# Altium schematic sheet [07] - POWER SUPPLY.SchDoc: Desk Digital Clock
size A4; DrawnBy: Ramil Teregulov; Address1: http://github.com/teregulov; Address2: http://github.com/teregulov/Desk-Digital-Clock; DocumentNumber: DDC-7; Revision: 1R0; SheetNumber: 7; SheetTotal: 7
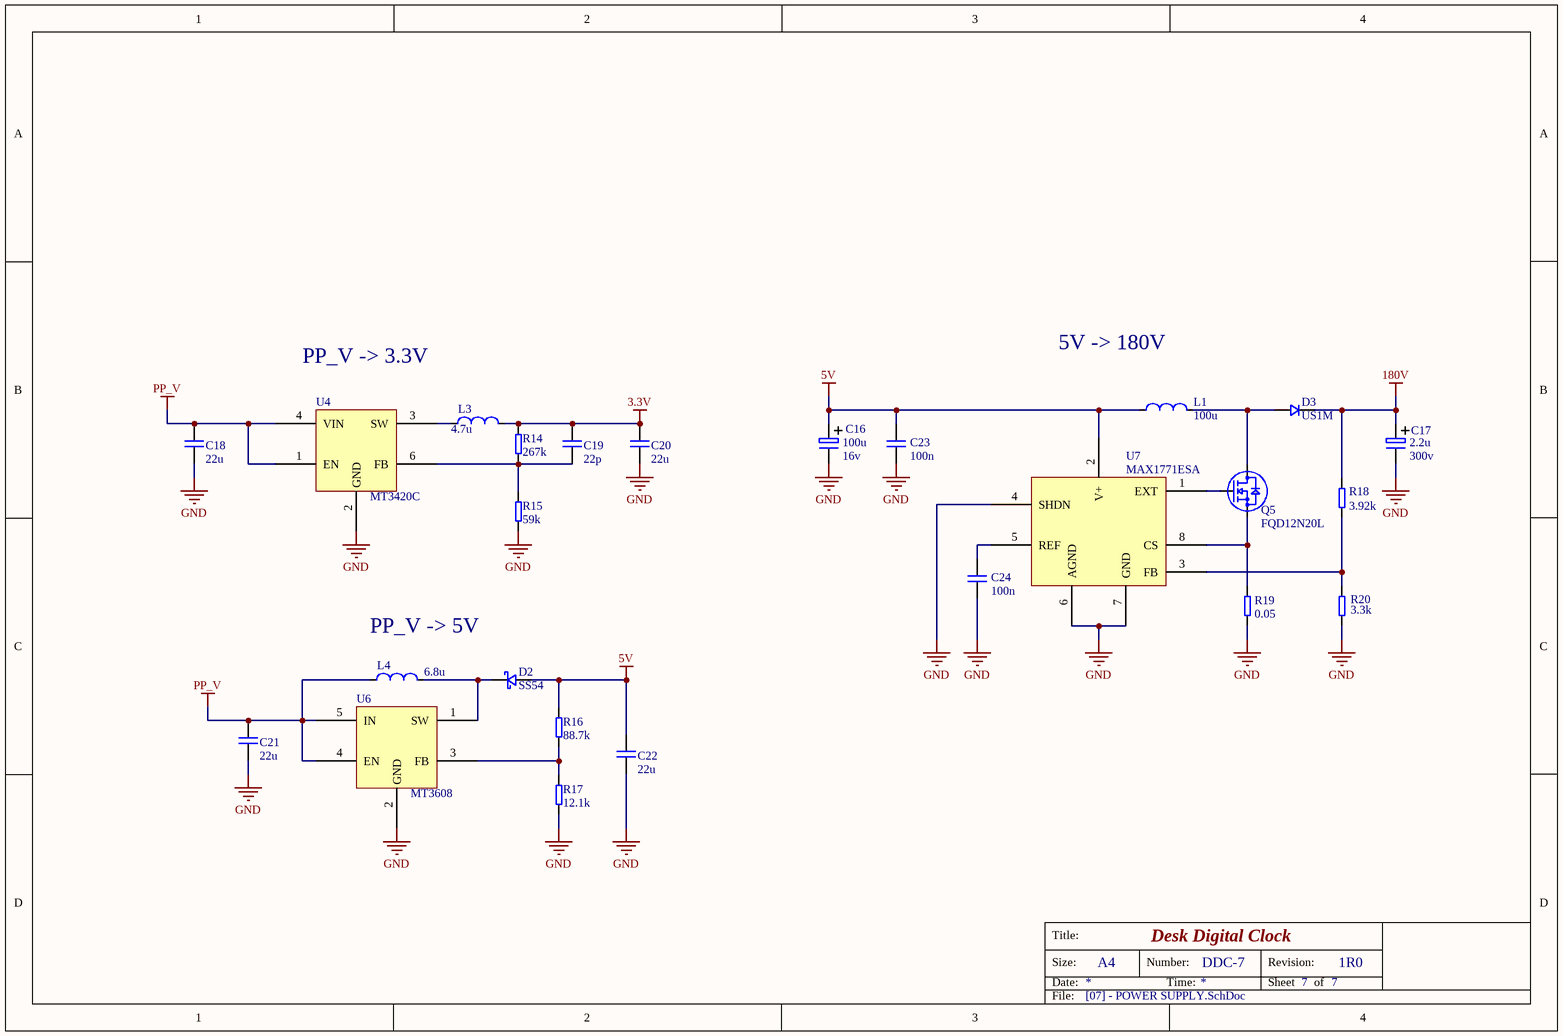
[diagram p0: [07] - POWER SUPPLY.SchDoc]

## Parts
C16  Voltage: 16v  [CAPM3216X18N_TANTAL_E]  (hidden comment: 100u)
C17  Voltage: 300v  [CAP_8X10.2]  (hidden comment: 2.2u)
C18  22u  [C1210]
C19  22p  [C0603]
C20  22u  [C1210]
C21  22u  [C1210]
C22  22u  [C1210]
C23  100n  [C0603]
C24  100n  [C0603]
D2  P/N: SS54  [DIOM6959X26N-SS54]
D3  (no value)  [DO-214AC(SMA)]
L1  100u  [CD127-IND]
L3  4.7u  [CDRH5D16]
L4  6.8u  [CDRH5D16]
Q5  FQD12N20L  [DPAK-fqd12n20l]
R14  267k  [R0603]
R15  59k  [R0603]
R16  88.7k  [R0603]
R17  12.1k  [R0603]
R18  3.92k  [R0603]
R19  0.05  [R1206]
R20  3.3k  [R0603]
U4  MT3420C  [SOT23-6-MT3420C]
U6  MT3608  [SOT23-6-MT3420C]
U7  MAX1771ESA  [MAX1771ESA]

## Nets
3.3V: C19.2 C20.2 L3.2 R14.2
5V: C16.1 C22.2 C23.2 D2.2 L1.1 R16.2 U7.2(V+)
180V: C17.1 D3.1 R18.2
GND: C16.2 C17.2 C18.1 C20.1 C21.1 C22.1 C23.1 C24.1 R15.1 R17.1 R19.1 R20.1 U4.2(GND) U6.2(GND) U7.4(SHDN) U7.6(AGND) U7.7(GND)
PP_V: C18.2 C21.2 L4.1 U4.1(EN) U4.4(VIN) U6.4(EN) U6.5(IN)
NetC19_1: C19.1 R14.1 R15.2 U4.6(FB)
NetC24_2: C24.2 U7.5(REF)
NetD2_1: D2.1 L4.2 U6.1(SW)
NetD3_2: D3.2 L1.2 Q5.D
NetL3_1: L3.1 U4.3(SW)
NetQ5_G: Q5.G U7.1(EXT)
NetQ5_S: Q5.S R19.2 U7.8(CS)
NetR16_1: R16.1 R17.2 U6.3(FB)
NetR18_1: R18.1 R20.2 U7.3(FB)

## Notes on the sheet
- PP_V -> 3.3V
- 5V -> 180V
- PP_V -> 5V
- Title:
- Size:
- Date:
- A4
- Number:
- Time:
- Revision:
- Sheet
- of
- File:

## Library data of the parts
C16 C17 = Cap_p: CAPACITOR
  C16: Value: 100u
  C17: Value: 2.2u
C18-C24 = Cap: CAPACITOR
  C18 C20-C22: Value: 22u
  C19: Value: 22p
  C23 C24: Value: 100n
D2 = Diode_Shottky: Diode Shottky; Datasheet: https://static.chipdip.ru/lib/321/DOC005321659.pdf
D3 = US1M: 1.0A SURFACE MOUNT ULTRA-FAST RECTIFIER; Manufacturer: Vishay; Datasheet: https://www.vishay.com/docs/88768/us1_test_dcicons.pdf; P/N: US1M
L1 = Ind: INDUCTOR; Value: 100u
L3 = Ind: INDUCTOR; P/N: CDRH5D16NP-4R7NC; Value: 4.7u
L4 = Ind: INDUCTOR; P/N: CDRH5D16NP-680MC; Value: 6.8u
Q5 = FQD12N20L: n-Channel QFET MOSFET 200V 9A 280mOhm; Manufacturer: Fairchild Semiconductor; P/N: FQD12N20L; Datasheet: https://www.onsemi.com/download/data-sheet/pdf/fqd12n20l-d.pdf; Package: D-PAK
R14-R20 = Res: RESISTOR
  R14: Value: 267k
  R15: Value: 59k
  R16: Value: 88.7k
  R17: Value: 12.1k
  R18: Value: 3.92k
  R19: Value: 0.05
  R20: Value: 3.3k
U4 = MT3420C: 2A 2.3-6V Input 1.5MHz Synchronous Step-Down Converter; Manufacturer: Aerosemi; Datasheet: https://datasheet.lcsc.com/lcsc/1806041635_XI-AN-Aerosemi-Tech-MT3420C_C181741.pdf; P/N: MT3420C
U6 = MT3608: High Efficiency 1.2MHz 2A Step Up Converter; Manufacturer: Aerosemi; Datasheet: https://www.olimex.com/Products/Breadboarding/BB-PWR-3608/resources/MT3608.pdf; P/N: MT3608
U7 = MAX1771ESA: 12V or Adjustable, High-Efficiency, / Low IQ, Step-Up DC-DC Controller; Manufacturer: Maxim; Datasheet: https://static.chipdip.ru/lib/300/DOC000300892.pdf; P/N: MAX1771ESA